# EAGLE design Transceiver 2 (EAGLE 6.3)
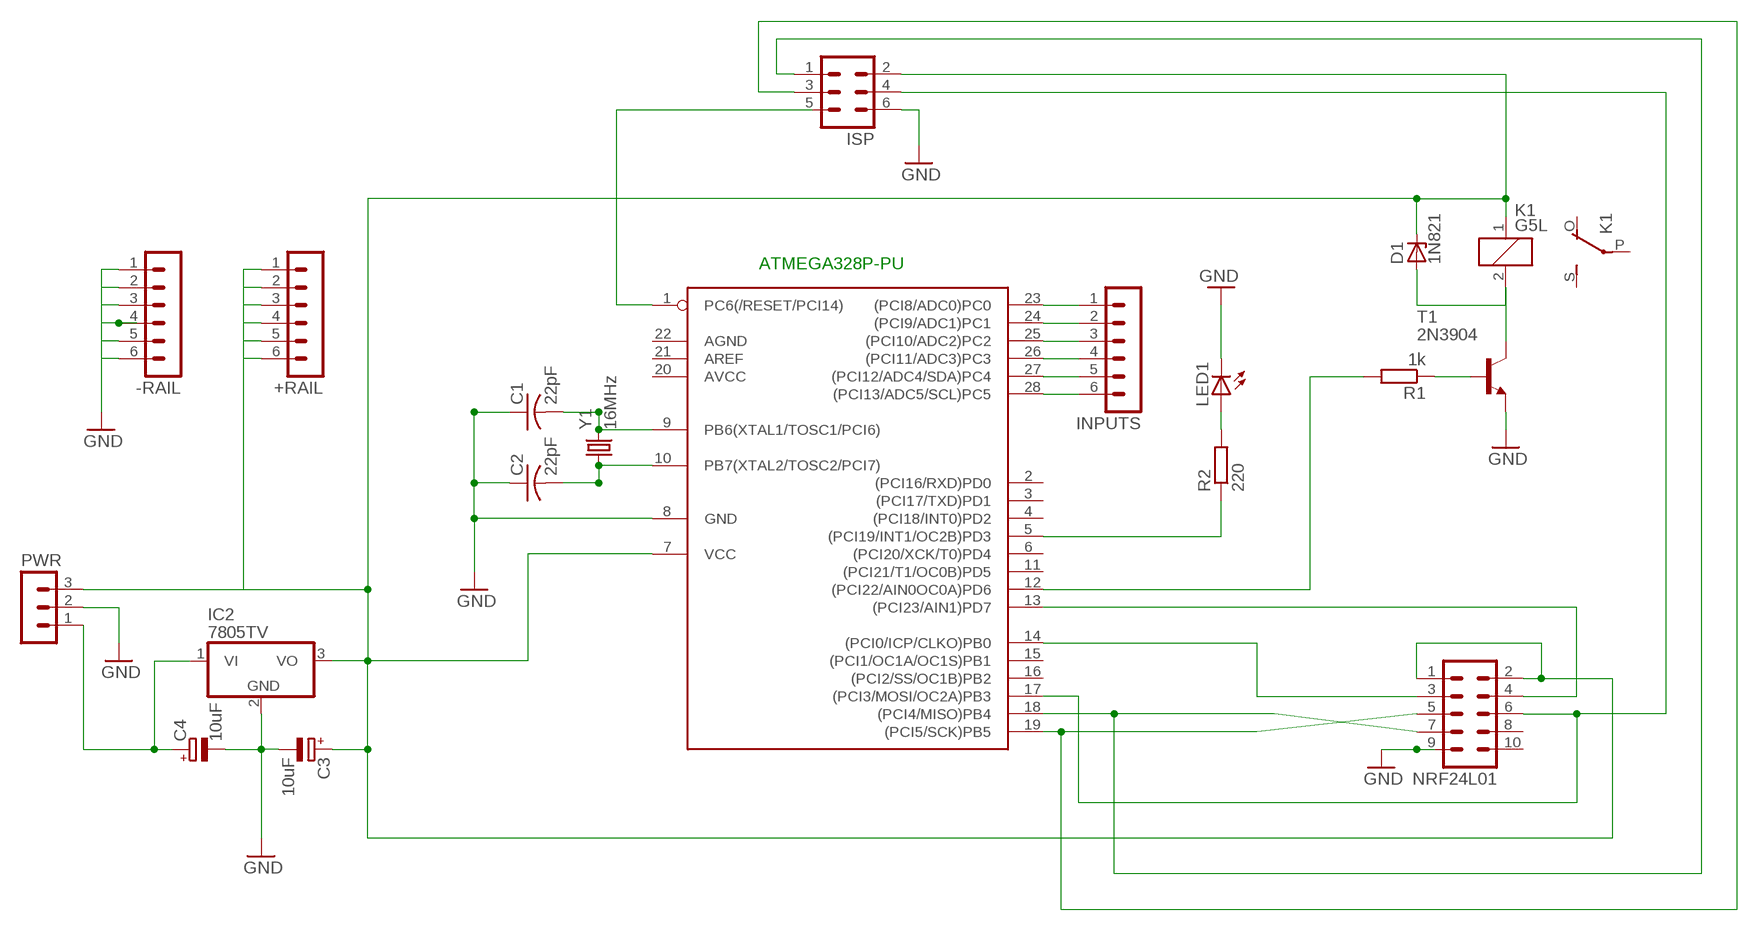
[diagram p0: schematic, sheet 1]

## Parts
+RAIL  MA06-1  [MA06-1]
-RAIL  MA06-1  [MA06-1]
C1  22pF  C-US025-024X044  [C025-024X044]
C2  22pF  C-US025-024X044  [C025-024X044]
C3  10uF  CPOL-EUE2-5  [E2-5]
C4  10uF  CPOL-EUE2-5  [E2-5]
D1  1N821  [DO35Z10]
IC1  ATMEGA168-20P  [DIL28-3]
IC2  7805TV  [TO220V]
INPUTS  MA06-1  [MA06-1]
ISP  MA03-2  [MA03-2]
K1  G5L  [G5LE]
LED1  LED3MM  [LED3MM]
NRF24L01  MA05-2  [MA05-2]
PWR  MA03-1  [MA03-1]
R1  1k  R-EU_0204/7  [0204/7]
R2  220  R-EU_0204/7  [0204/7]
T1  2N3904  [TO92]
Y1  16MHz  CRYSTALHC49US  [HC49US]

## Nets
5VRAIL: +RAIL.1 +RAIL.2 +RAIL.3 +RAIL.4 +RAIL.5 +RAIL.6 C3.+ D1.C IC1.7(VCC) IC2.3(VO) ISP.2 K1.1 NRF24L01.1 NRF24L01.2 PWR.3
GND: -RAIL.1 -RAIL.2 -RAIL.3 -RAIL.4 -RAIL.5 -RAIL.6 C1.1 C2.1 C3.- C4.- IC1.8(GND) IC2.2(GND) ISP.6 LED1.K(C) NRF24L01.9 PWR.2 T1.3(E)
N$1: IC1.14((PCI0/ICP/CLKO)PB0) NRF24L01.3
N$2: C1.2 IC1.9(PB6(XTAL1/TOSC1/PCI6)) Y1.2
N$3: C2.2 IC1.10(PB7(XTAL2/TOSC2/PCI7)) Y1.1
N$4: IC1.19((PCI5/SCK)PB5) ISP.3 NRF24L01.5
N$6: IC1.13((PCI23/AIN1)PD7) NRF24L01.4
N$7: IC1.17((PCI3/MOSI/OC2A)PB3) ISP.4 NRF24L01.6
N$10: C4.+ IC2.1(VI) PWR.1
N$14: IC1.12((PCI22/AIN0OC0A)PD6) R1.2
N$15: IC1.5((PCI19/INT1/OC2B)PD3) R2.1
N$16: LED1.A R2.2
N$19: IC1.1(PC6(/RESET/PCI14)) ISP.5
N$20: D1.A K1.2 T1.1(C)
N$21: R1.1 T1.2(B)
N$24: IC1.28((PCI13/ADC5/SCL)PC5) INPUTS.6
N$25: IC1.27((PCI12/ADC4/SDA)PC4) INPUTS.5
N$27: IC1.18((PCI4/MISO)PB4) ISP.1 NRF24L01.7
N$30: IC1.23((PCI8/ADC0)PC0) INPUTS.1
N$31: IC1.24((PCI9/ADC1)PC1) INPUTS.2
N$32: IC1.25((PCI10/ADC2)PC2) INPUTS.3
N$33: IC1.26((PCI11/ADC3)PC3) INPUTS.4
Unconnected: IC1.2((PCI16/RXD)PD0) IC1.3((PCI17/TXD)PD1) IC1.4((PCI18/INT0)PD2) IC1.6((PCI20/XCK/T0)PD4) IC1.11((PCI21/T1/OC0B)PD5) IC1.15((PCI1/OC1A/OC1S)PB1) IC1.16((PCI2/SS/OC1B)PB2) IC1.20(AVCC) IC1.21(AREF) IC1.22(AGND) K1.O(2:O) K1.P(2:P) K1.S(2:S) NRF24L01.8 NRF24L01.10

## Notes on the sheet
- ATMEGA328P-PU

## Library data of the parts
+RAIL -RAIL INPUTS = con-lstb:MA06-1: PIN HEADER; OC_FARNELL: unknown; OC_NEWARK: unknown
C1 C2 = adafruit:C-US: CAPACITOR, American symbol
C3 C4 = rcl:CPOL-EU: POLARIZED CAPACITOR, European symbol
D1 = diode:1N821: Reference DIODE temperature compensated, 6,2 V
IC1 = adafruit:ATMEGA168*P: MICROCONTROLLER 16 kBytes FLASH 1 kBytes SRAM 512 Bytes EEPROM USART 8-channel 10 bit ADC
IC2 = linear:78*: Positive VOLTAGE REGULATOR Source: http://cache.national.com/ds/LM/LM78L05.pdf http://www.fairchildsemi.com/ds/LM/LM7805.pdf
ISP = con-lstb:MA03-2: PIN HEADER; OC_FARNELL: unknown; OC_NEWARK: unknown
K1 = relay:G5L: RELAY 1 x switch, 10 A/120 V AC, 8 A/30 V ADC, Omron; OC_FARNELL: unknown; OC_NEWARK: unknown
LED1 = led:LED: LED OSRAM: - CHIPLED LG R971, LG N971, LY N971, LG Q971, LY Q971, LO R971, LY R971 LH N974, LH R974 LS Q976, LO Q976, LY Q976 LO Q996 - Hyper CHIPLED LW Q18S LB Q993, LB Q99A, LB R99A - SideLED LS A670, LO A670, LY A670, LG A670, LP A670 LB A673, LV A673, LT A673, LW A673 LH A674 LY A675 LS A676, LA A676, LO A676, LY A676, LW A676 LS A679, LY A679, LG A679 - Hyper Micro SIDELED® LS Y876, LA Y876, LO Y876, LY Y876 LT Y87S - SmartLED LW L88C, LW L88S LB L89C, LB L89S, LG L890 LS L89K, LO L89K, LY L89K LS L896, LA L896, LO L896, LY L896 - TOPLED LS T670, LO T670, LY T670, LG T670, LP T670 LSG T670, LSP T670, LSY T670, LOP T670, LYG T670 LG T671, LOG T671, LSG T671 LB T673, LV T673, LT T673, LW T673 LH T674 LS T676, LA T676, LO T676, LY T676, LB T676, LH T676, LSB T676, LW T676 LB T67C, LV T67C, LT T67C, LS T67K, LO T67K, LY T67K, LW E67C LS E67B, LA E67B, LO E67B, LY E67B, LB E67C, LV E67C, LT E67C LW T67C LS T679, LY T679, LG T679 LS T770, LO T770, LY T770, LG T770, LP T770 LB T773, LV T773, LT T773, LW T773 LH T774 LS E675, LA E675, LY E675, LS T675 LS T776, LA T776, LO T776, LY T776, LB T776 LHGB T686 LT T68C, LB T68C - Hyper Mini TOPLED® LB M676 - Mini TOPLED Santana® LG M470 LS M47K, LO M47K, LY M47K Source: http://www.osram.convergy.de LUXEON: - LUMILED® LXK2-PW12-R00, LXK2-PW12-S00, LXK2-PW14-U00, LXK2-PW14-V00 LXK2-PM12-R00, LXK2-PM12-S00, LXK2-PM14-U00 LXK2-PE12-Q00, LXK2-PE12-R00, LXK2-PE12-S00, LXK2-PE14-T00, LXK2-PE14-U00 LXK2-PB12-K00, LXK2-PB12-L00, LXK2-PB12-M00, LXK2-PB14-N00, LXK2-PB14-P00, LXK2-PB14-Q00 LXK2-PR12-L00, LXK2-PR12-M00, LXK2-PR14-Q00, LXK2-PR14-R00 LXK2-PD12-Q00, LXK2-PD12-R00, LXK2-PD12-S00 LXK2-PH12-R00, LXK2-PH12-S00 LXK2-PL12-P00, LXK2-PL12-Q00, LXK2-PL12-R00 Source: www.luxeon.com KINGBRIGHT: KA-3528ASYC Source: www.kingbright.com
NRF24L01 = con-lstb:MA05-2: PIN HEADER; OC_FARNELL: unknown; OC_NEWARK: unknown
PWR = con-lstb:MA03-1: PIN HEADER; OC_FARNELL: unknown; OC_NEWARK: unknown
R1 R2 = rcl:R-EU_: RESISTOR, European symbol
T1 = transistor:2N3904: NPN TRANSISTOR
Y1 = SparkFun:CRYSTAL: Crystals Various standard crystals. Proven footprints. Spark Fun Electronics SKU : COM-00534

## Board
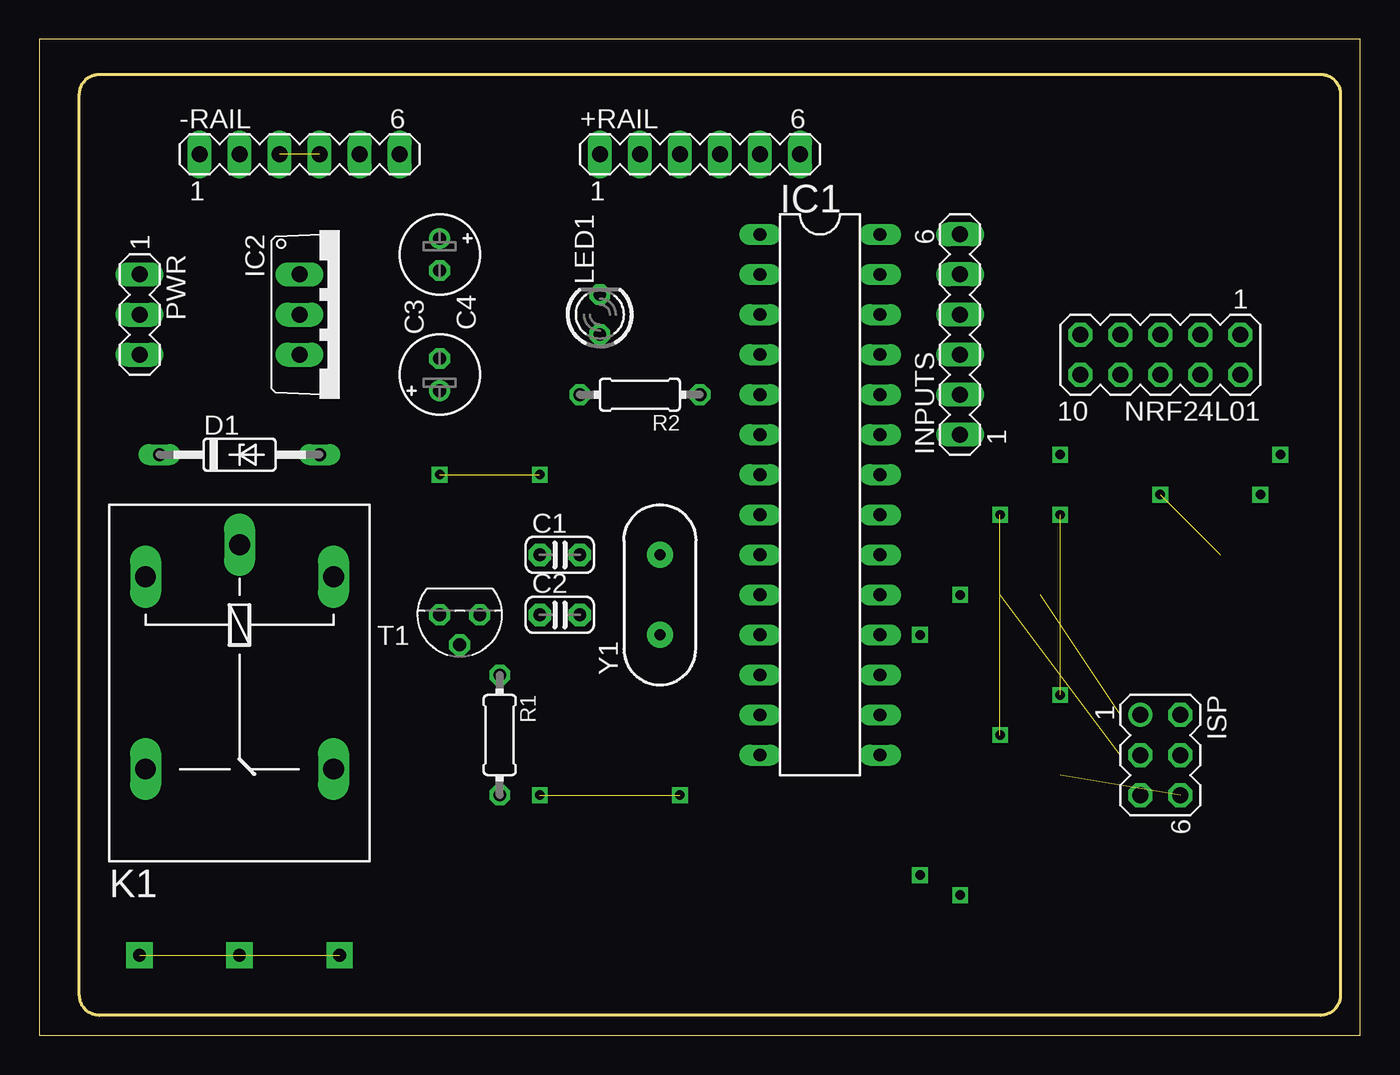
[diagram p1: board, top side]
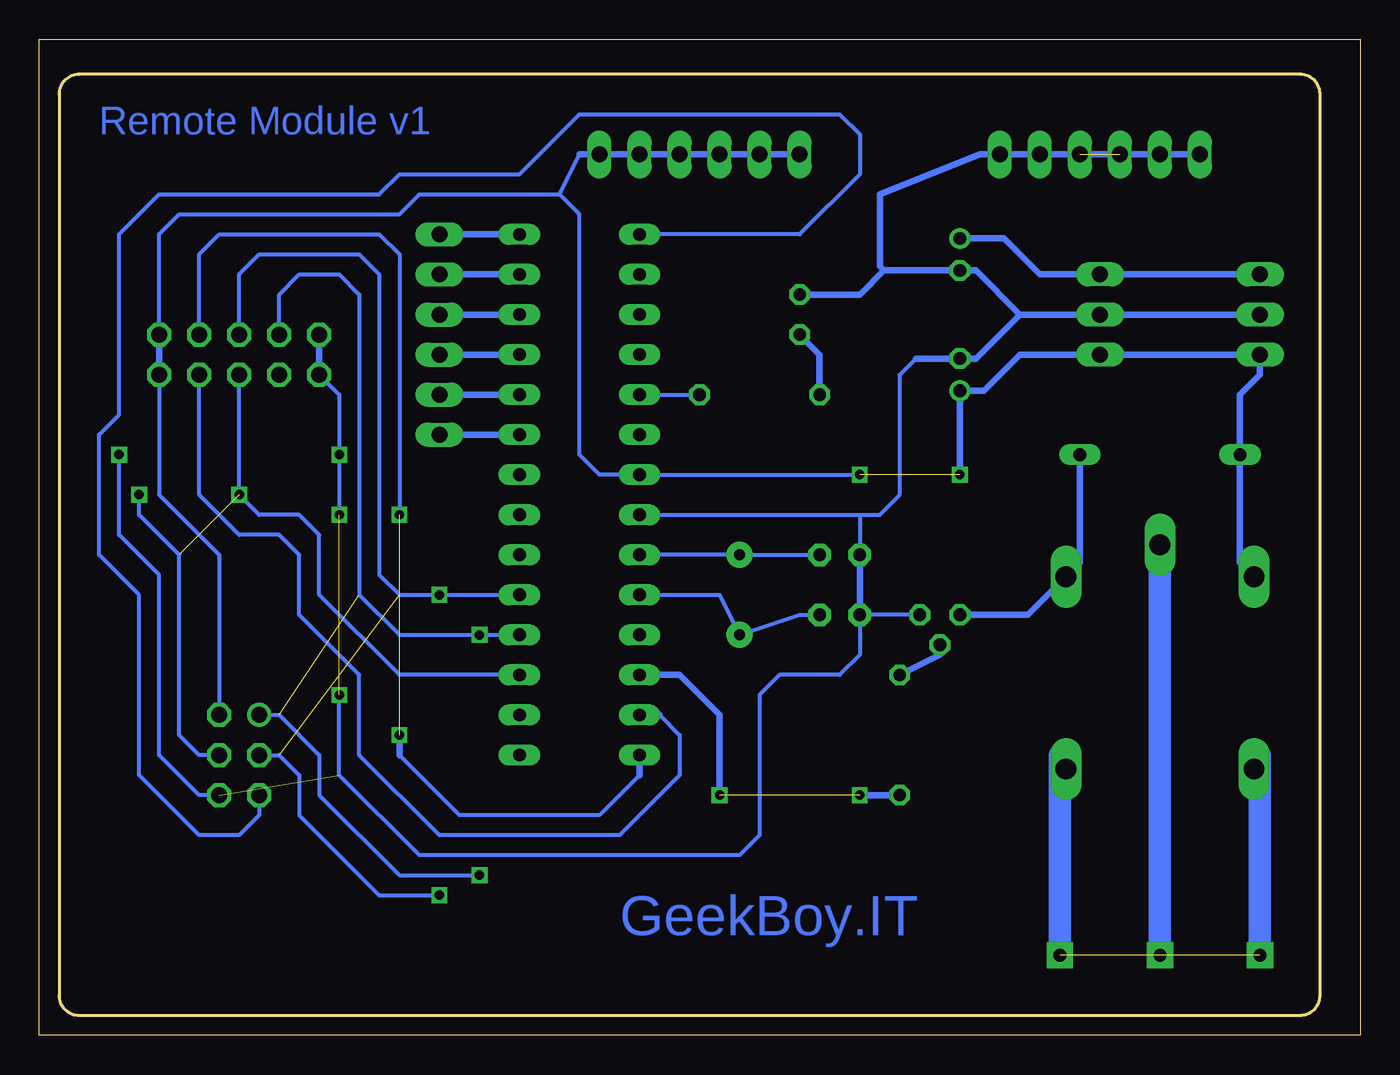
[diagram p2: board, bottom side, seen from below]

Size 83.8 x 63.17 mm. Coordinates in mm from the lower left corner, seen from the top.
Outline: 0,0 83.8,0 83.8,63.17 0,63.17 0,0
Copper layers (1*16): Top 0.035mm / dielectric 1.5mm / Bottom 0.035mm
Design rules "default": minimum track width 10mil, minimum drill 24mil, track to track 8mil, track to pad 8mil, pad to pad 8mil, via to via 8mil, smd to smd 8mil, copper to edge 40mil, drill to drill 8mil, minimum pad ring 10mil, minimum via ring 8mil, stop-mask expansion 4mil, vias tented up to drill 0mil, thermal gap 10mil
Milling: 8 lines

### Footprints (pad centres in the part's own frame; a part is rotated, then mirrored left to right if it is on the bottom)
MA06-1 = drill 1.016 long: 1 -6.35,0; 2 -3.81,0; 3 -1.27,0; 4 1.27,0; 5 3.81,0; 6 6.35,0
C025-024X044 = drill 0.813 pad 1.422 octagon: 1 -1.27,0; 2 1.27,0
E2-5 = drill 0.813 pad 1.27: + -1.016,0 | drill 0.813 pad 1.27 octagon: - 1.016,0
DO35Z10 = drill 0.813 long: A 5.08,0; C -5.08,0
DIL28-3 = drill 0.813 long: 1 -16.51,-3.81; 2 -13.97,-3.81; 3 -11.43,-3.81; 4 -8.89,-3.81; 5 -6.35,-3.81; 6 -3.81,-3.81; 7 -1.27,-3.81; 8 1.27,-3.81; 9 3.81,-3.81; 10 6.35,-3.81; 11 8.89,-3.81; 12 11.43,-3.81; 13 13.97,-3.81; 14 16.51,-3.81; 15 16.51,3.81; 16 13.97,3.81; 17 11.43,3.81; 18 8.89,3.81; 19 6.35,3.81; 20 3.81,3.81; 21 1.27,3.81; 22 -1.27,3.81; 23 -3.81,3.81; 24 -6.35,3.81; 25 -8.89,3.81; 26 -11.43,3.81; 27 -13.97,3.81; 28 -16.51,3.81
TO220V = drill 1.016 long: 1 -2.54,-2.54; 2 0,-2.54; 3 2.54,-2.54
MA03-2 = drill 1.016: 1 -2.54,-1.27 | drill 1.016 octagon: 2 -2.54,1.27; 3 0,-1.27; 4 0,1.27; 5 2.54,-1.27; 6 2.54,1.27
G5LE = drill 1.321 long: 1 -7.493,-5.969; 2 -7.493,5.969; O 4.699,5.969; P -9.525,0; S 4.699,-5.969
LED3MM = drill 0.813 octagon: A -1.27,0; K 1.27,0
MA05-2 = drill 1.016 octagon: 1 -5.08,-1.27; 2 -5.08,1.27; 3 -2.54,-1.27; 4 -2.54,1.27; 5 0,-1.27; 6 0,1.27; 7 2.54,-1.27; 8 2.54,1.27; 9 5.08,-1.27; 10 5.08,1.27
MA03-1 = drill 1.016 long: 1 -2.54,0; 2 0,0; 3 2.54,0
0204/7 = drill 0.813 octagon: 1 -3.81,0; 2 3.81,0
TO92 = drill 0.813 octagon: 1 1.27,0; 2 0,1.905; 3 -1.27,0
HC49US = drill 0.7 pad 1.651: 1 -2.54,0; 2 2.54,0

### Placement (x,y rotation side)
+RAIL  41.91,55.88 0 top
-RAIL  16.51,55.88 0 top
C1  33.02,30.48 0 top
C2  33.02,26.67 0 top
C3  25.4,41.91 90 top
C4  25.4,49.53 270 top
D1  12.7,36.83 0 top
IC1  49.53,34.29 270 top
IC2  19.05,45.72 270 top
INPUTS  58.42,44.45 90 top
ISP  71.12,17.78 270 top
K1  12.7,21.59 270 top
LED1  35.56,45.72 90 top
NRF24L01  71.12,43.18 180 top
PWR  6.35,45.72 270 top
R1  29.21,19.05 270 top
R2  38.1,40.64 180 top
T1  26.67,26.67 180 top
Y1  39.37,27.94 90 top

### Tracks (layer width: path | path; a pad name or v marks a point on that pad's centre or on a via)
5VRAIL  (via drill 0.6)  (1 unrouted)
  Bottom 0.254: v31.75,35.56 IC1.7 48.26,35.56 49.53,36.83 49.53,52.07 50.8,53.34 | 50.8,53.34 49.53,55.88 | NRF24L01.1 76.2,50.8 74.93,52.07 60.96,52.07 59.69,53.34 50.8,53.34 | NRF24L01.2 76.2,34.29 72.39,30.48 ISP.2
  Bottom 0.406: v25.4,35.56 C3.+ 23.88,40.89 21.59,43.18 IC2.3 PWR.3 6.35,41.91 7.62,40.64 D1.C 7.62,29.97 K1.1 | NRF24L01.2 NRF24L01.1 | 49.53,55.88 +RAIL.6 +RAIL.5 +RAIL.4 +RAIL.3 +RAIL.2 +RAIL.1
GND  (via drill 0.6)  (3 unrouted)
  Bottom 0.254: 31.75,33.02 30.48,33.02 29.21,34.29 29.21,41.91 28.19,42.93 | IC1.8 31.75,33.02 | 31.75,33.02 C1.1 31.75,24.13 33.02,22.86 36.83,22.86 38.1,21.59 38.1,12.7 39.37,11.43 59.69,11.43 64.77,16.51 v64.77,21.59 | T1.3 C2.1 | 66.04,41.91 64.77,40.64 v64.77,36.83 v64.77,33.02 | ISP.6 73.66,15.24 76.2,17.78 76.2,29.21 78.74,31.75 78.74,36.83
  Bottom 0.406: 21.59,45.72 IC2.2 PWR.2 | 21.59,45.72 24.38,48.51 C4.- 30.21,48.51 | 21.59,45.72 24.38,42.93 C3.- | C1.1 C2.1 | C3.- 25.65,43.18 | 28.19,42.93 C3.- | -RAIL.1 -RAIL.2 -RAIL.3 -RAIL.5 -RAIL.6 24.13,55.88 30.48,53.34 30.48,48.79 30.21,48.51 | LED1.K 31.73,46.99 30.21,48.51 | NRF24L01.9 66.04,41.91
N$1  (via drill 0.6)  (1 unrouted)
  Bottom 0.254: NRF24L01.3 73.66,49.53 72.39,50.8 62.23,50.8 60.96,49.53 v60.96,33.02 | 45.72,16.51 48.26,13.97 57.15,13.97 60.96,17.78
  Bottom 0.406: IC1.14 45.72,16.51 | 60.96,17.78 v60.96,19.05
N$2
  Bottom 0.254: IC1.9 Y1.2 C1.2
N$3
  Bottom 0.254: IC1.10 40.64,27.94 Y1.1 35.56,26.67 C2.2
N$4  (via drill 0.6)  (1 unrouted)
  Bottom 0.254: NRF24L01.5 71.12,48.26 69.85,49.53 63.5,49.53 62.23,48.26 62.23,29.21 60.96,27.94 v58.42,27.94 IC1.19 | ISP.3 68.58,17.78 67.31,16.51 67.31,13.97 62.23,8.89 v58.42,8.89
N$6
  Bottom 0.254: 44.45,20.32 43.18,19.05 43.18,16.51 46.99,12.7 58.42,12.7 63.5,17.78 63.5,22.86 67.31,26.67 67.31,30.48 68.58,31.75 71.12,31.75 73.66,34.29 NRF24L01.4
  Bottom 0.406: IC1.13 44.45,20.32
N$7  (via drill 0.6)  (1 unrouted)
  Bottom 0.254: IC1.17 60.96,22.86 66.04,27.94 66.04,31.75 67.31,33.02 69.85,33.02 v71.12,34.29 NRF24L01.6 | ISP.4 73.66,17.78 74.93,19.05 74.93,30.48 77.47,33.02 v77.47,34.29
N$9  (via drill 0.6)
  other vias: 40.64,15.24
N$10
  Bottom 0.406: C4.+ 22.61,50.55 20.32,48.26 IC2.1 PWR.1
N$14  (1 unrouted)
  Bottom 0.406: R1.2 31.75,15.24 | IC1.12 43.18,22.86 40.64,20.32 40.64,15.24
N$15
  Bottom 0.254: IC1.5 R2.1
N$16
  Bottom 0.406: LED1.A 34.29,43.18 R2.2
N$19
  Bottom 0.254: ISP.5 69.85,13.97 71.12,12.7 73.66,12.7 77.47,16.51 77.47,27.94 80.01,30.48 80.01,38.1 78.74,39.37 78.74,50.8 76.2,53.34 62.23,53.34 60.96,54.61 53.34,54.61 49.53,58.42 33.02,58.42 31.75,57.15 31.75,54.61 35.56,50.8 IC1.1
N$20
  Bottom 0.406: D1.A 17.78,29.97 K1.2 21.08,26.67 T1.1
N$21
  Bottom 0.406: R1.1 26.67,24.13 T1.2
N$22  (via drill 0.6)
  other vias: 31.75,15.24
N$23  (via drill 0.8 pad 1.68)  (2 unrouted)
  Bottom 1.422: v19.05,5.08 19.05,17.78 | 12.7,30.48 v12.7,5.08 | 6.35,17.78 v6.35,5.08
N$24
  Bottom 0.406: IC1.28 INPUTS.6
N$25
  Bottom 0.406: IC1.27 INPUTS.5
N$27  (via drill 0.6)  (1 unrouted)
  Bottom 0.254: NRF24L01.7 68.58,46.99 67.31,48.26 64.77,48.26 63.5,46.99 63.5,27.94 60.96,25.4 v55.88,25.4 IC1.18 | ISP.1 68.58,20.32 66.04,17.78 66.04,15.24 60.96,10.16 v55.88,10.16
N$28  (via drill 0.6)
  other vias: 78.74,36.83
N$30
  Bottom 0.406: IC1.23 INPUTS.1
N$31
  Bottom 0.406: IC1.24 INPUTS.2
N$32
  Bottom 0.406: IC1.25 INPUTS.3
N$33
  Bottom 0.406: IC1.26 INPUTS.4

### Text on the board
Bottom: Remote Module v1 | GeekBoy.IT